# Altium project TD2_Project_TX.PrjPcb
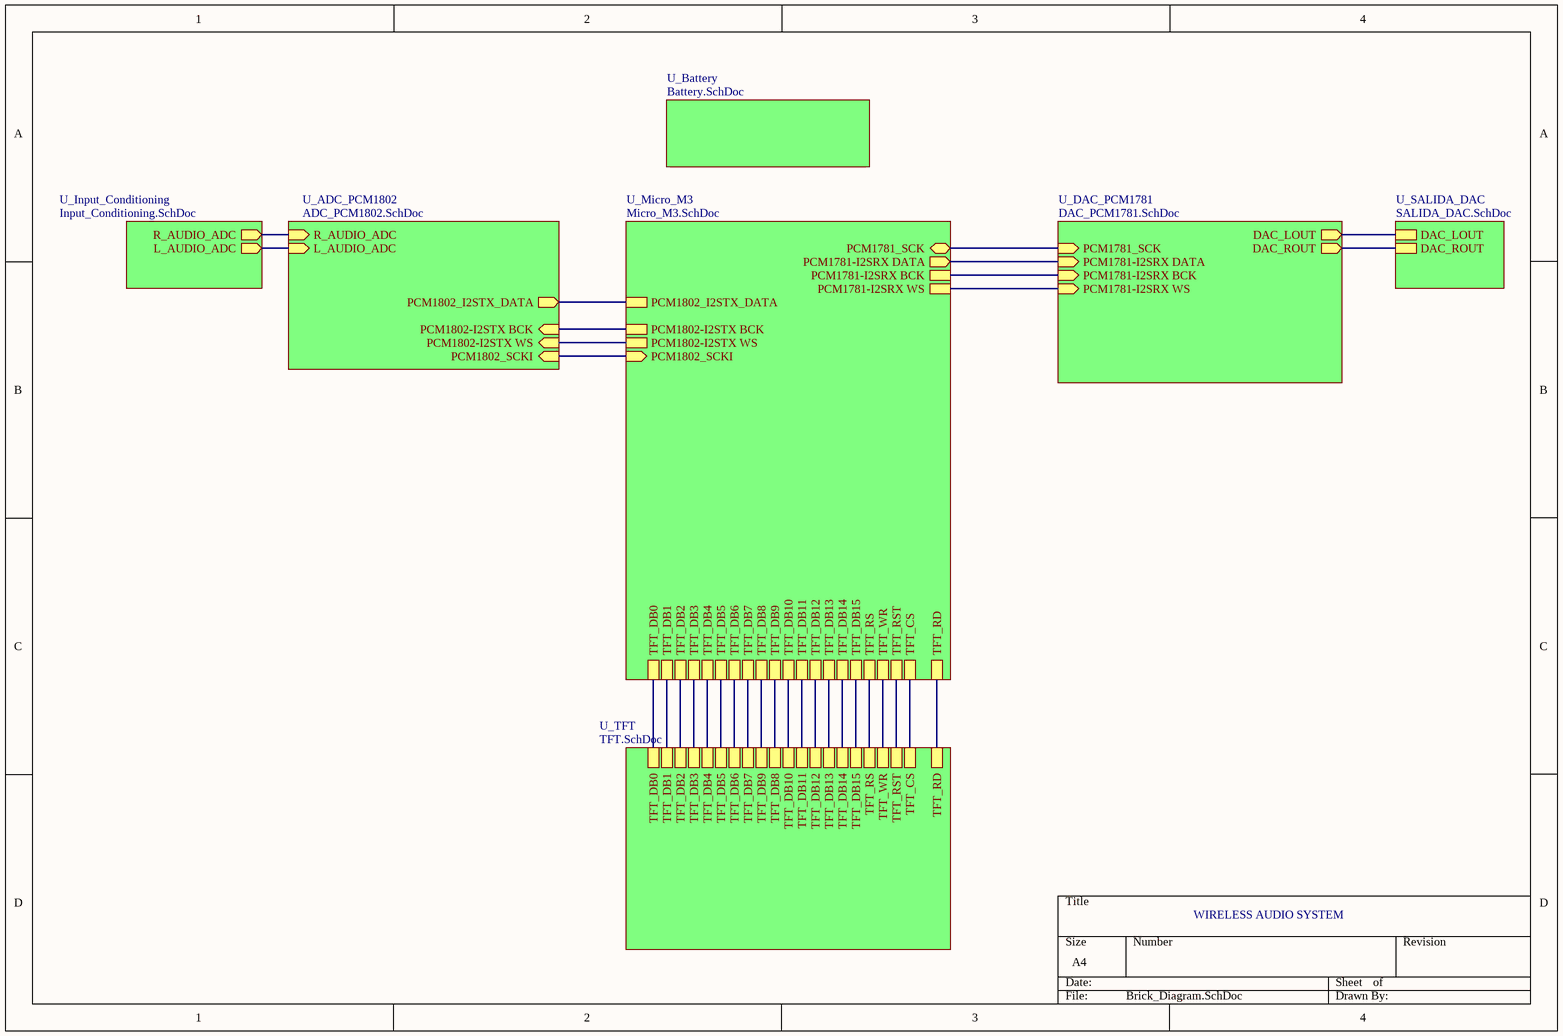
[diagram p0: Brick_Diagram.SchDoc]
8 sheets, 94 parts. Net scope: hierarchical (ports join the sheet entries above them; power ports are global).
Board file: TD2_Project_TX.PcbDoc
Sheets:
  Brick_Diagram.SchDoc
    U_Battery = Battery.SchDoc
    U_Input_Conditioning = Input_Conditioning.SchDoc
    U_DAC_PCM1781 = DAC_PCM1781.SchDoc
    U_Micro_M3 = Micro_M3.SchDoc
    U_ADC_PCM1802 = ADC_PCM1802.SchDoc
    U_SALIDA_DAC = SALIDA_DAC.SchDoc
    U_TFT = TFT.SchDoc

## Sheet Brick_Diagram.SchDoc
size A4

### Sub-sheets
U_ADC_PCM1802 = ADC_PCM1802.SchDoc: L_AUDIO_ADC (in), R_AUDIO_ADC (in), PCM1802-I2STX BCK (in), PCM1802_I2STX_DATA (out), PCM1802_SCKI (in), PCM1802-I2STX WS (in)
U_Battery = Battery.SchDoc: no entries
U_DAC_PCM1781 = DAC_PCM1781.SchDoc: PCM1781-I2SRX DATA (in), PCM1781-I2SRX BCK (in), PCM1781_SCK (in), PCM1781-I2SRX WS (in), DAC_LOUT (out), DAC_ROUT (out)
U_Input_Conditioning = Input_Conditioning.SchDoc: R_AUDIO_ADC (out), L_AUDIO_ADC (out)
U_Micro_M3 = Micro_M3.SchDoc: PCM1781_SCK (bidir), PCM1802-I2STX BCK, PCM1802-I2STX WS, PCM1802_I2STX_DATA, PCM1781-I2SRX BCK, PCM1781-I2SRX WS, PCM1781-I2SRX DATA (out), PCM1802_SCKI (in), TFT_DB0, TFT_DB1, TFT_DB2, TFT_DB4, TFT_DB5, TFT_DB3, TFT_DB6, TFT_DB8, TFT_DB9, TFT_DB7, TFT_DB10, TFT_DB11, TFT_DB12, TFT_DB13, TFT_DB14, TFT_DB15, TFT_RS, TFT_WR, TFT_RST, TFT_CS, TFT_RD
U_SALIDA_DAC = SALIDA_DAC.SchDoc: DAC_LOUT, DAC_ROUT
U_TFT = TFT.SchDoc: TFT_CS, TFT_WR, TFT_RST, TFT_DB0, TFT_DB1, TFT_DB2, TFT_DB3, TFT_DB4, TFT_DB5, TFT_DB6, TFT_DB7, TFT_DB9, TFT_DB8, TFT_DB10, TFT_DB11, TFT_DB12, TFT_DB13, TFT_DB14, TFT_DB15, TFT_RS, TFT_RD

### Nets
DAC_LOUT: sheet U_DAC_PCM1781/DAC_LOUT, sheet U_SALIDA_DAC/DAC_LOUT
DAC_ROUT: sheet U_DAC_PCM1781/DAC_ROUT, sheet U_SALIDA_DAC/DAC_ROUT
DB0: sheet U_Micro_M3/TFT_DB0, sheet U_TFT/TFT_DB0
DB1: sheet U_Micro_M3/TFT_DB1, sheet U_TFT/TFT_DB1
DB2: sheet U_Micro_M3/TFT_DB2, sheet U_TFT/TFT_DB2
DB3: sheet U_Micro_M3/TFT_DB3, sheet U_TFT/TFT_DB3
DB4: sheet U_Micro_M3/TFT_DB4, sheet U_TFT/TFT_DB4
DB5: sheet U_Micro_M3/TFT_DB5, sheet U_TFT/TFT_DB5
DB6: sheet U_Micro_M3/TFT_DB6, sheet U_TFT/TFT_DB6
DB7: sheet U_Micro_M3/TFT_DB7, sheet U_TFT/TFT_DB7
DB8: sheet U_Micro_M3/TFT_DB9, sheet U_TFT/TFT_DB8
DB9: sheet U_Micro_M3/TFT_DB8, sheet U_TFT/TFT_DB9
DB10: sheet U_Micro_M3/TFT_DB10, sheet U_TFT/TFT_DB10
DB11: sheet U_Micro_M3/TFT_DB11, sheet U_TFT/TFT_DB11
DB12: sheet U_Micro_M3/TFT_DB12, sheet U_TFT/TFT_DB12
DB13: sheet U_Micro_M3/TFT_DB13, sheet U_TFT/TFT_DB13
DB14: sheet U_Micro_M3/TFT_DB14, sheet U_TFT/TFT_DB14
DB15: sheet U_Micro_M3/TFT_DB15, sheet U_TFT/TFT_DB15
L_AUDIO_ADC: sheet U_Input_Conditioning/L_AUDIO_ADC, sheet U_ADC_PCM1802/L_AUDIO_ADC
PCM1781-BCK: sheet U_DAC_PCM1781/PCM1781-I2SRX BCK, sheet U_Micro_M3/PCM1781-I2SRX BCK
PCM1781-I2SRX DATA: sheet U_DAC_PCM1781/PCM1781-I2SRX DATA, sheet U_Micro_M3/PCM1781-I2SRX DATA
PCM1781-I2SRX WS: sheet U_DAC_PCM1781/PCM1781-I2SRX WS, sheet U_Micro_M3/PCM1781-I2SRX WS
PCM1781_SCK: sheet U_DAC_PCM1781/PCM1781_SCK, sheet U_Micro_M3/PCM1781_SCK
PCM1802_BCK: sheet U_Micro_M3/PCM1802-I2STX BCK, sheet U_ADC_PCM1802/PCM1802-I2STX BCK
PCM1802_DOUT: sheet U_Micro_M3/PCM1802_I2STX_DATA, sheet U_ADC_PCM1802/PCM1802_I2STX_DATA
PCM1802_LRCK: sheet U_Micro_M3/PCM1802-I2STX WS, sheet U_ADC_PCM1802/PCM1802-I2STX WS
PCM1802_SCKL: sheet U_Micro_M3/PCM1802_SCKI, sheet U_ADC_PCM1802/PCM1802_SCKI
R_AUDIO_ADC: sheet U_Input_Conditioning/R_AUDIO_ADC, sheet U_ADC_PCM1802/R_AUDIO_ADC
TFT_CS: sheet U_Micro_M3/TFT_CS, sheet U_TFT/TFT_CS
TFT_RD: sheet U_Micro_M3/TFT_RD, sheet U_TFT/TFT_RD
TFT_RS: sheet U_Micro_M3/TFT_RS, sheet U_TFT/TFT_RS
TFT_RST: sheet U_Micro_M3/TFT_RST, sheet U_TFT/TFT_RST
TFT_WR: sheet U_Micro_M3/TFT_WR, sheet U_TFT/TFT_WR

### Notes on the sheet
- WIRELESS AUDIO SYSTEM

## Sheet Battery.SchDoc
size A4
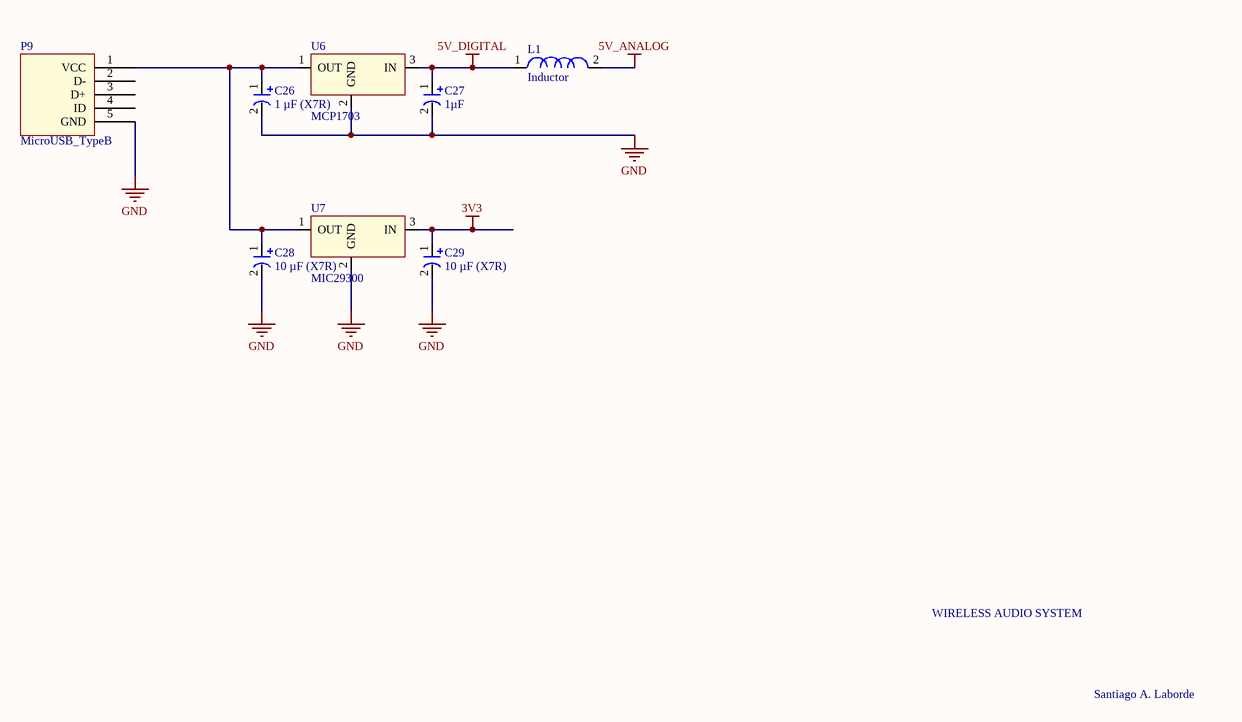
[diagram p1: Battery.SchDoc]

### Parts
C26  1 µF (X7R)  [RAD-0.1]
C27  1µF  [RAD-0.1]
C28  10 µF (X7R)  [RAD-0.1]
C29  10 µF (X7R)  [RAD-0.1]
L1  Inductor  [R_0805]
P9  MicroUSB_TypeB  [*TE_2013499-1]
U6  MCP1703  [SOT-223-3]
U7  MIC29300  [TO-263-3]

### Nets
3V3: C29.1 U7.3(IN)
5V_ANALOG: L1.2
5V_DIGITAL: C27.1 L1.1 U6.3(IN)
GND: C26.2 C27.2 C28.2 C29.2 P9.5(GND) U6.2(GND) U7.2(GND)  [project net DGND]
NetC26_1: C26.1 C28.1 P9.1(VCC) U6.1(OUT) U7.1(OUT)

Not connected (* = marked no-connect by the designer): P9 2(D-) 3(D+) 4(ID)

### Notes on the sheet
- WIRELESS AUDIO SYSTEM
- Santiago A. Laborde

### Library data of the parts
C26-C29 = Capacitor_Pol: Polarysed Capacitor
U6 = MCP1703: low dropout positive voltage regulators that / are capable of providing an output current that is in excess of 1.0 A / with a maximum dropout voltage of 1.2 V at 800 mA over / temperature. This series contains nine fixed output voltages of 1.5 V, / 1.8 V, 1.9 V, 2.0 V, 2.5 V, 2.85 V, 3.3 V, 5.0 V, and 12 V that have no / minimum load requirement to maintain regulation
U7 = MIC29300: low dropout positive voltage regulators that / are capable of providing an output current that is in excess of 1.0 A / with a maximum dropout voltage of 1.2 V at 800 mA over / temperature. This series contains nine fixed output voltages of 1.5 V, / 1.8 V, 1.9 V, 2.0 V, 2.5 V, 2.85 V, 3.3 V, 5.0 V, and 12 V that have no / minimum load requirement to maintain regulation

## Sheet Input_Conditioning.SchDoc
size A4
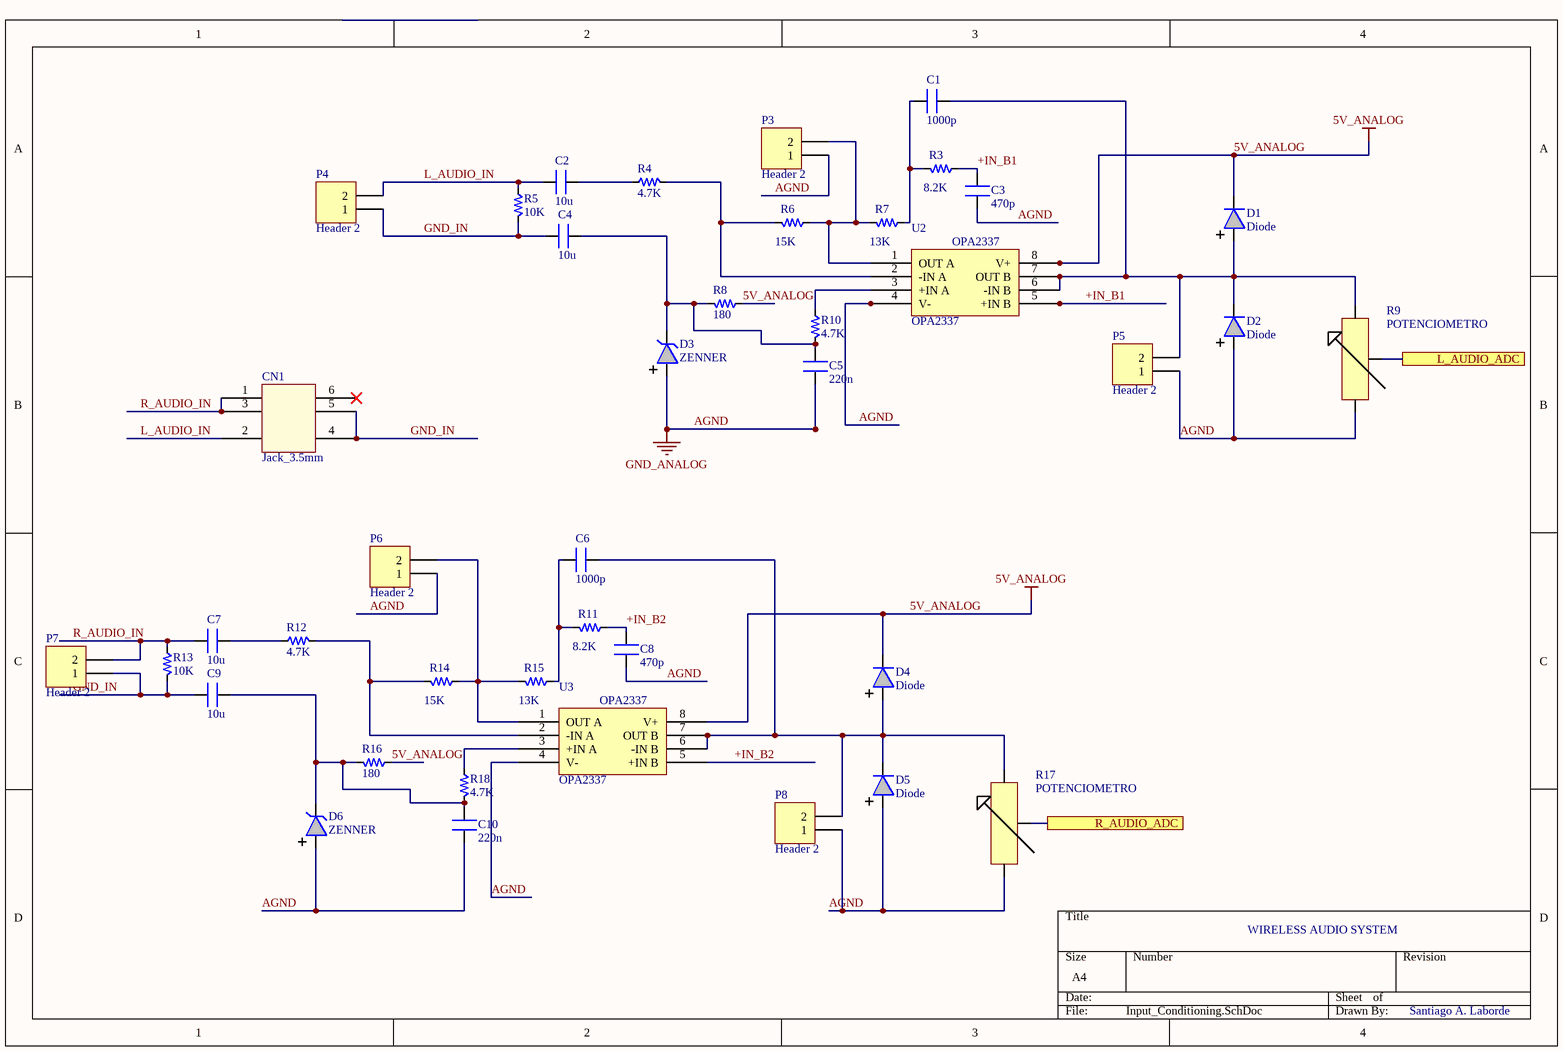
[diagram p2: Input_Conditioning.SchDoc]

### Parts
C1  1000p  [C_0805]
C2  10u  [RAD-0.1]
C3  470p  [C_0805]
C4  10u  [RAD-0.1]
C5  220n  [C_0805]
C6  1000p  [C_0805]
C7  10u  [RAD-0.1]
C8  470p  [C_0805]
C9  10u  [RAD-0.1]
C10  220n  [C_0805]
CN1  Jack_3.5mm  [JACK_3.5mm]
D1  Diode  [LED_0805]
D2  Diode  [LED_0805]
D3  ZENNER  [SOD123]
D4  Diode  [LED_0805]
D5  Diode  [LED_0805]
D6  ZENNER  [SOD123]
P3  Header 2  [Header1x2]
P4  Header 2  [Header1x2]
P5  Header 2  [Header1x2]
P6  Header 2  [Header1x2]
P7  Header 2  [Header1x2]
P8  Header 2  [Header1x2]
R3  8.2K  [R_0805]
R4  4.7K  [R_0805]
R5  10K  [R_0805]
R6  15K  [R_0805]
R7  13K  [R_0805]
R8  180  [R_0805]
R9  POTENCIOMETRO  [Potenciometro]
R10  4.7K  [R_0805]
R11  8.2K  [R_0805]
R12  4.7K  [R_0805]
R13  10K  [R_0805]
R14  15K  [R_0805]
R15  13K  [R_0805]
R16  180  [R_0805]
R17  POTENCIOMETRO  [Potenciometro]
R18  4.7K  [R_0805]
U2  OPA2337  [SOIC-8N]
U3  OPA2337  [SOIC-8N]

### Ports
L_AUDIO_ADC, R_AUDIO_ADC

### Nets
5V_ANALOG: D1.2 D4.2 R8.2 R16.2 U2.8(V+) U3.8(V+)
AGND: C3.2 C5.2 C8.2 C10.2 D2.1 D3.1 D5.1 D6.1 P3.1 P5.1 P6.1 P8.1 R9.2 R17.2 U2.4(V-) U3.4(V-)  [also labelled GND_ANALOG]
+IN_B1: C3.1 R3.2 U2.5(+IN_B)
+IN_B2: C8.1 R11.2 U3.5(+IN_B)
GND_IN: C4.1 C9.1 CN1.4 CN1.5 P4.1 P7.1 R5.1 R13.1
L_AUDIO_ADC: R9.3 ; port L_AUDIO_ADC
L_AUDIO_IN: C2.2 CN1.2 P4.2 R5.2
R_AUDIO_ADC: R17.3 ; port R_AUDIO_ADC
R_AUDIO_IN: C7.2 CN1.1 CN1.3 P7.2 R13.2
NetC1_1: C1.1 R3.1 R7.2
NetC1_2: C1.2 D1.1 D2.2 P5.2 R9.1 U2.6(-IN_B) U2.7(OUT_B)
NetC2_1: C2.1 R4.2
NetC4_2: C4.2 C5.1 D3.2 R8.1 R10.1
NetC6_1: C6.1 R11.1 R15.2
NetC6_2: C6.2 D4.1 D5.2 P8.2 R17.1 U3.6(-IN_B) U3.7(OUT_B)
NetC7_1: C7.1 R12.2
NetC9_2: C9.2 C10.1 D6.2 R16.1 R18.1
NetP3_2: P3.2 R6.2 R7.1 U2.1(OUT_A)
NetP6_2: P6.2 R14.2 R15.1 U3.1(OUT_A)
NetR4_1: R4.1 R6.1 U2.2(-IN_A)
NetR10_2: R10.2 U2.3(+IN_A)
NetR12_1: R12.1 R14.1 U3.2(-IN_A)
NetR18_2: R18.2 U3.3(+IN_A)

Not connected (* = marked no-connect by the designer): CN1 6*

### Notes on the sheet
- WIRELESS AUDIO SYSTEM
- Santiago A. Laborde

### Library data of the parts
C1-C10 = Capacitor_NP: Non Polarised Capacitor
P3-P8 = Header 2: Header, 2-Pin; LatestRevisionDate: 17-Jul-2002; LatestRevisionNote: Re-released for DXP Platform.; Publisher: Altium Limited
R3-R8 R10-R16 R18 = Resistor
R9 R17 = POTENCIOMETRO: pin to pad: 1>3 2>1 3>2

## Sheet DAC_PCM1781.SchDoc
size A4
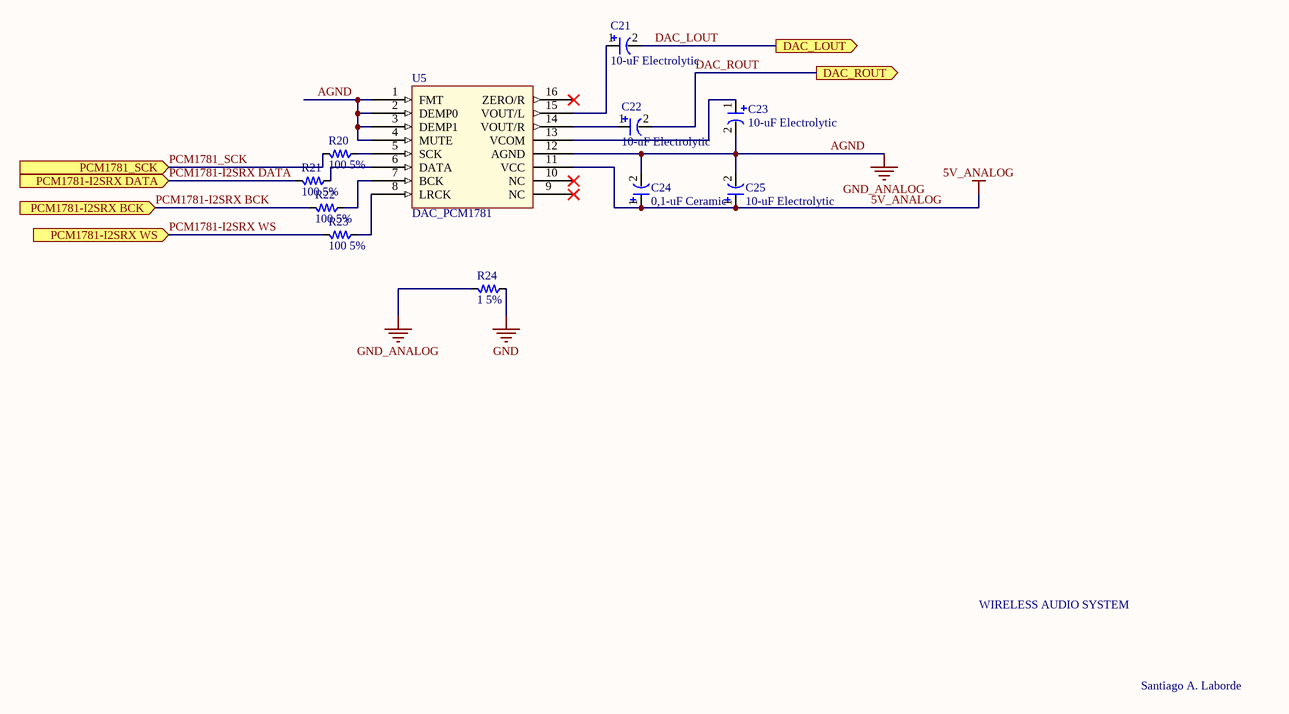
[diagram p3: DAC_PCM1781.SchDoc]

### Parts
C21  10-uF Electrolytic  [14-1210]
C22  10-uF Electrolytic  [14-1210]
C23  10-uF Electrolytic  [14-1210]
C24  0,1-uF Ceramic  [C_0805_Pol]
C25  10-uF Electrolytic  [14-1210]
R20  100 5%  [R_0805]
R21  100 5%  [R_0805]
R22  100 5%  [R_0805]
R23  100 5%  [R_0805]
R24  1 5%  [R_0805]
U5  DAC_PCM1781  [SSOP (16)]

### Ports
DAC_LOUT (out), DAC_ROUT (out), PCM1781-I2SRX BCK (in), PCM1781-I2SRX DATA (in), PCM1781-I2SRX WS (in), PCM1781_SCK (in)

### Nets
5V_ANALOG: C24.1 C25.1 U5.11(VCC)
AGND: C23.2 C24.2 C25.2 R24.1 U5.1(FMT) U5.2(DEMP0) U5.3(DEMP1) U5.4(MUTE) U5.12(AGND)  [also labelled GND_ANALOG]
GND: R24.2  [project net DGND]
DAC_LOUT: C21.2 ; port DAC_LOUT
DAC_ROUT: C22.2 ; port DAC_ROUT
PCM1781-I2SRX BCK: R22.1 ; port PCM1781-I2SRX BCK  [project net PCM1781-BCK]
PCM1781-I2SRX DATA: R21.1 ; port PCM1781-I2SRX DATA
PCM1781-I2SRX WS: R23.1 ; port PCM1781-I2SRX WS
PCM1781_SCK: R20.1 ; port PCM1781_SCK
NetC21_1: C21.1 U5.15(VOUT/L)
NetC22_1: C22.1 U5.14(VOUT/R)
NetC23_1: C23.1 U5.13(VCOM)
NetR20_2: R20.2 U5.5(SCK)
NetR21_2: R21.2 U5.6(DATA)
NetR22_2: R22.2 U5.7(BCK)
NetR23_2: R23.2 U5.8(LRCK)

Not connected (* = marked no-connect by the designer): U5 9(NC)* 10(NC)* 16(ZERO/R)*

### Notes on the sheet
- WIRELESS AUDIO SYSTEM
- Santiago A. Laborde

### Library data of the parts
C21-C25 = Capacitor_Pol: Polarysed Capacitor
R20-R24 = Resistor
U5 = DAC_PCM1781: The PCM1780/81/82 is a CMOS, monolithic, integrated circuit, which includes stereo digital-to-analog converters and support circuitry in a small 16-lead SSOP package. The data converters use TI’s enhanced multilevel delta-sigma architecture to achieve excellent dynamic performance an improved tolerance to clock jitter. Sampling rates up to 200 kHz are supported.

## Sheet Micro_M3.SchDoc
size B; Author: Santiago A. Laborde
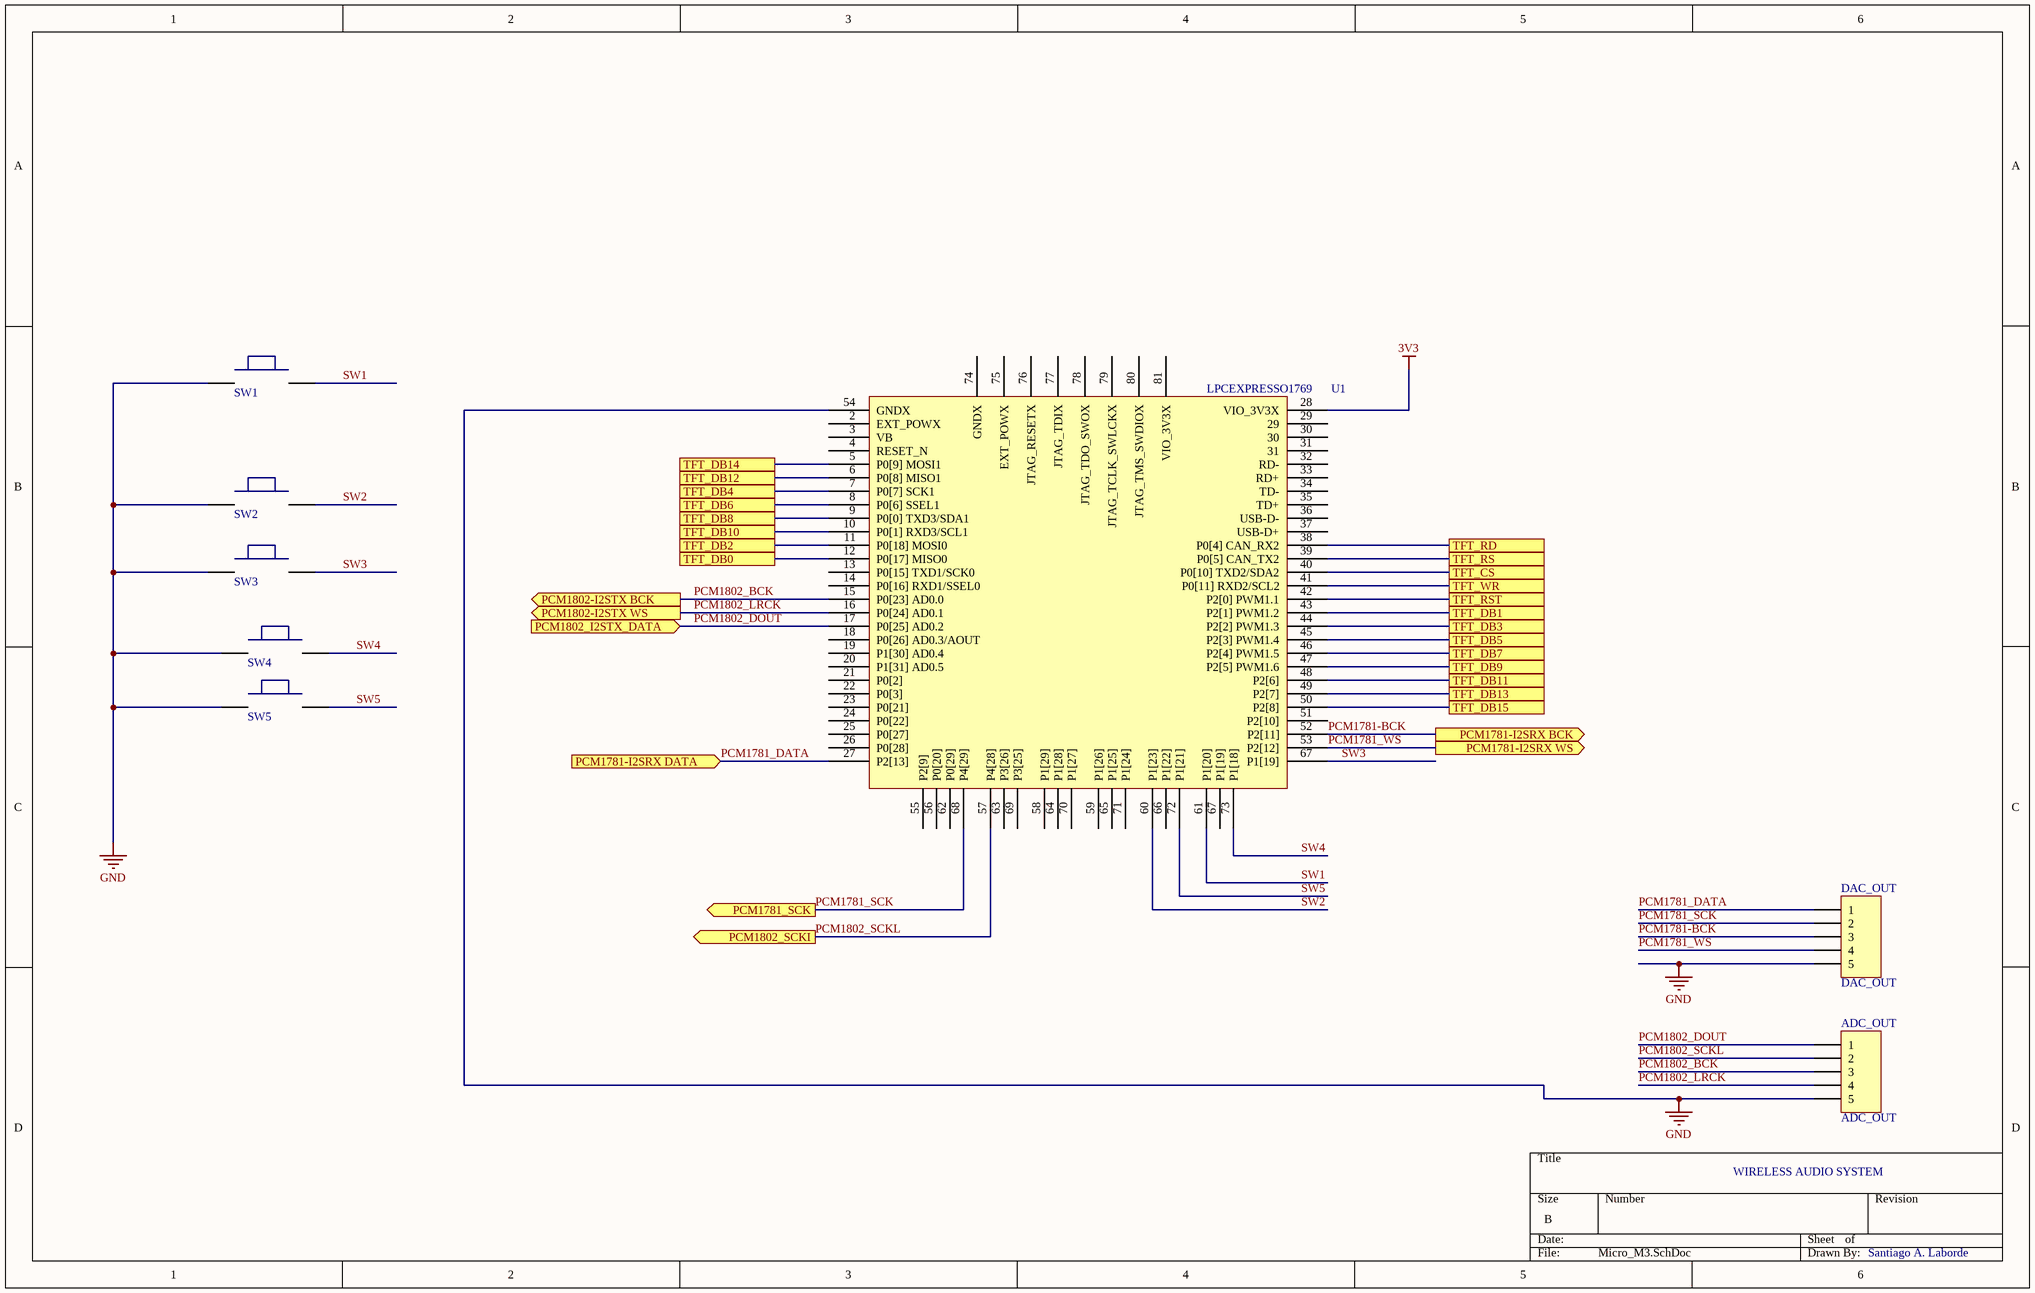
[diagram p4: Micro_M3.SchDoc]

### Parts
ADC_OUT  ADC_OUT  [HDR1X5]
DAC_OUT  DAC_OUT  [HDR1X5]
SW1  PULSADOR  [Pulsador]  (value not drawn)
SW2  PULSADOR  [Pulsador]  (value not drawn)
SW3  PULSADOR  [Pulsador]  (value not drawn)
SW4  PULSADOR  [Pulsador]  (value not drawn)
SW5  PULSADOR  [SW_SMD(2)]  (value not drawn)
U1  LPCEXPRESSO1769  [LPCEXPRESSO1769]

### Ports
PCM1781-I2SRX BCK (out), PCM1781-I2SRX DATA (in), PCM1781-I2SRX WS (out), PCM1781_SCK (out), PCM1802-I2STX BCK (out), PCM1802-I2STX WS (out), PCM1802_I2STX_DATA (in), PCM1802_SCKI (out), TFT_CS, TFT_DB0, TFT_DB1, TFT_DB2, TFT_DB3, TFT_DB4, TFT_DB5, TFT_DB6, TFT_DB7, TFT_DB8, TFT_DB9, TFT_DB10, TFT_DB11, TFT_DB12, TFT_DB13, TFT_DB14, TFT_DB15, TFT_RD, TFT_RS, TFT_RST, TFT_WR

### Nets
3V3: U1.28(VIO_3V3X)
GND: ADC_OUT.5 DAC_OUT.5 SW1.1 SW2.1 SW3.1 SW4.1 SW5.1 U1.54(GNDX)  [project net DGND]
DB0: U1.12(P0[17]_MISO0) ; port TFT_DB0
DB1: U1.43(P2[1]_PWM1.2) ; port TFT_DB1
DB2: U1.11(P0[18]_MOSI0) ; port TFT_DB2
DB3: U1.44(P2[2]_PWM1.3) ; port TFT_DB3
DB4: U1.7(P0[7]_SCK1) ; port TFT_DB4
DB5: U1.45(P2[3]_PWM1.4) ; port TFT_DB5
DB6: U1.8(P0[6]_SSEL1) ; port TFT_DB6
DB7: U1.46(P2[4]_PWM1.5) ; port TFT_DB7
DB8: U1.47(P2[5]_PWM1.6) ; port TFT_DB9
DB9: U1.9(P0[0]_TXD3/SDA1) ; port TFT_DB8
DB10: U1.10(P0[1]_RXD3/SCL1) ; port TFT_DB10
DB11: U1.48(P2[6]) ; port TFT_DB11
DB12: U1.6(P0[8]_MISO1) ; port TFT_DB12
DB13: U1.49(P2[7]) ; port TFT_DB13
DB14: U1.5(P0[9]_MOSI1) ; port TFT_DB14
DB15: U1.50(P2[8]) ; port TFT_DB15
PCM1781-BCK: DAC_OUT.3 U1.52(P2[11]) ; port PCM1781-I2SRX BCK
PCM1781_DATA: DAC_OUT.1 U1.27(P2[13]) ; port PCM1781-I2SRX DATA  [project net PCM1781-I2SRX DATA]
PCM1781_SCK: DAC_OUT.2 U1.68(P4[29]) ; port PCM1781_SCK
PCM1781_WS: DAC_OUT.4 U1.53(P2[12]) ; port PCM1781-I2SRX WS  [project net PCM1781-I2SRX WS]
PCM1802_BCK: ADC_OUT.3 U1.15(P0[23]_AD0.0) ; port PCM1802-I2STX BCK
PCM1802_DOUT: ADC_OUT.1 U1.17(P0[25]_AD0.2) ; port PCM1802_I2STX_DATA
PCM1802_LRCK: ADC_OUT.4 U1.16(P0[24]_AD0.1) ; port PCM1802-I2STX WS
PCM1802_SCKL: ADC_OUT.2 U1.57(P4[28]) ; port PCM1802_SCKI
SW1: SW1.2 U1.61(P1[20])
SW2: SW2.2 U1.60(P1[23])
SW3: SW3.2 U1.67(P1[19])
SW4: SW4.2 U1.73(P1[18])
SW5: SW5.2 U1.72(P1[21])
TFT_CS: U1.40(P0[10]_TXD2/SDA2) ; port TFT_CS
TFT_RD: U1.38(P0[4]_CAN_RX2) ; port TFT_RD
TFT_RS: U1.39(P0[5]_CAN_TX2) ; port TFT_RS
TFT_RST: U1.42(P2[0]_PWM1.1) ; port TFT_RST
TFT_WR: U1.41(P0[11]_RXD2/SCL2) ; port TFT_WR

Not connected (* = marked no-connect by the designer): U1 2(EXT_POWX) 3(VB) 4(RESET_N) 13(P0[15]_TXD1/SCK0) 14(P0[16]_RXD1/SSEL0) 18(P0[26]_AD0.3/AOUT) 19(P1[30]_AD0.4) 20(P1[31]_AD0.5) 21(P0[2]) 22(P0[3]) 23(P0[21]) 24(P0[22]) 25(P0[27]) 26(P0[28]) 29 30 31 32(RD-) 33(RD+) 34(TD-) 35(TD+) 36(USB-D-) 37(USB-D+) 51(P2[10]) 55(P2[9]) 56(P0[20]) 58(P1[29]) 59(P1[26]) 62(P0[29]) 63(P3[26]) 64(P1[28]) 65(P1[25]) 66(P1[22]) 69(P3[25]) 70(P1[27]) 71(P1[24]) 74(GNDX) 75(EXT_POWX) 76(JTAG_RESETX) 77(JTAG_TDIX) 78(JTAG_TDO_SWOX) 79(JTAG_TCLK_SWLCKX) 80(JTAG_TMS_SWDIOX) 81(VIO_3V3X)

### Notes on the sheet
- WIRELESS AUDIO SYSTEM

### Library data of the parts
ADC_OUT DAC_OUT = Header 5: Header, 5-Pin; LatestRevisionDate: 17-Jul-2002; LatestRevisionNote: Re-released for DXP Platform.; Publisher: Altium Limited

## Sheet ADC_PCM1802.SchDoc
size A4
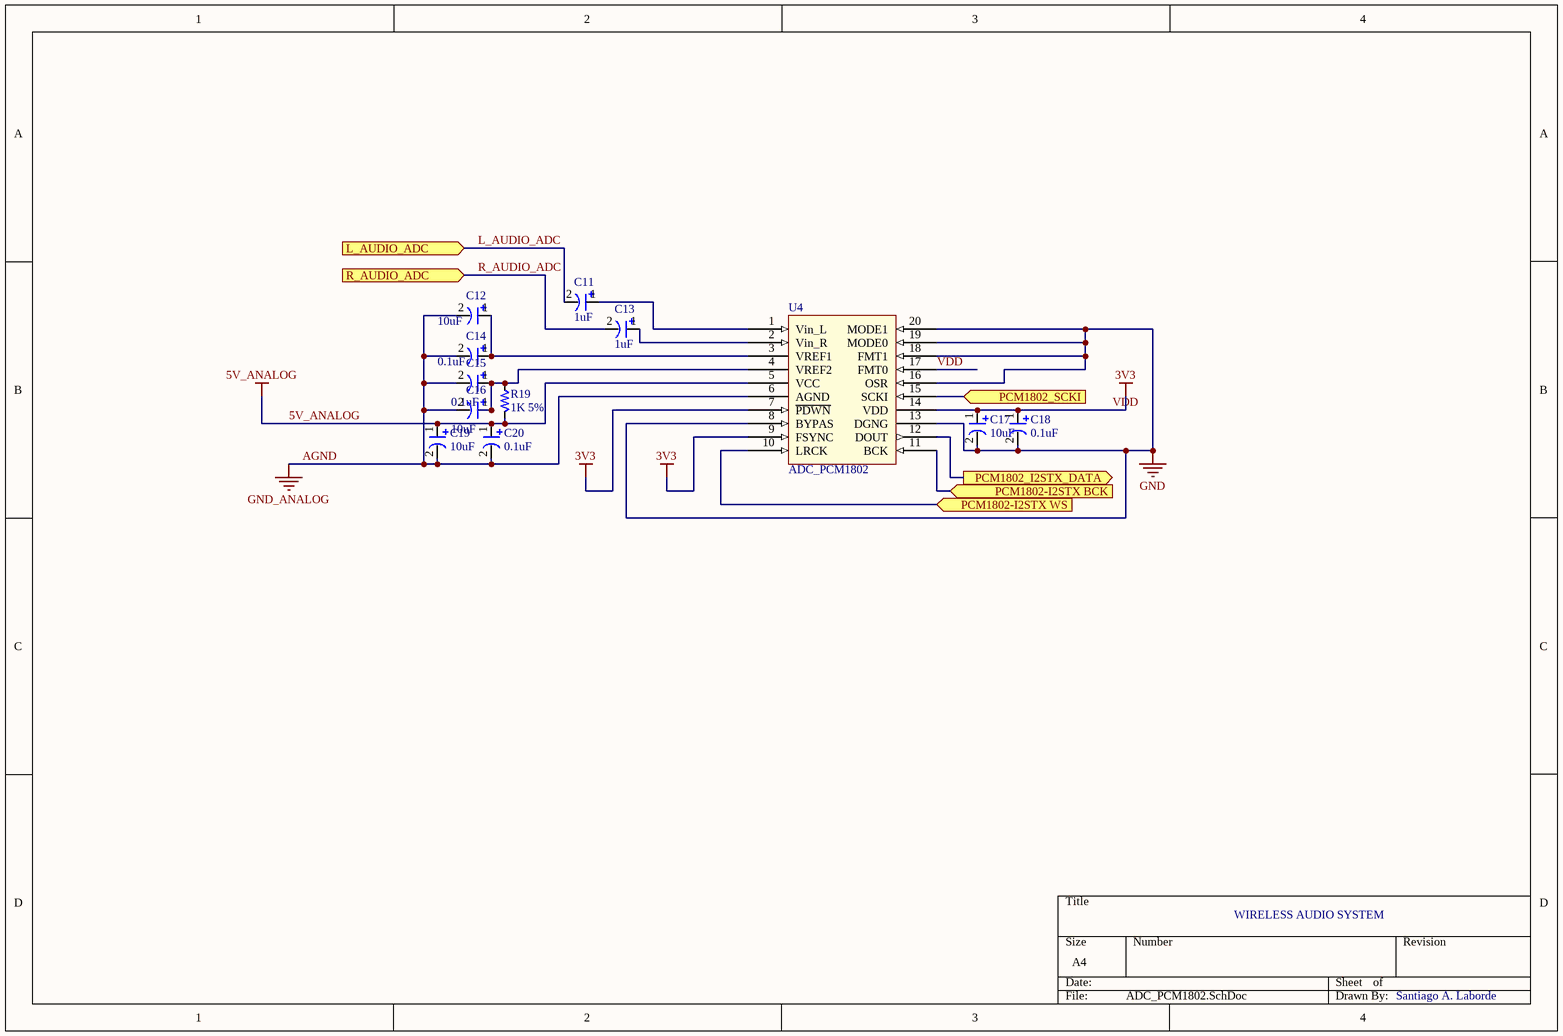
[diagram p5: ADC_PCM1802.SchDoc]

### Parts
C11  1uF  [RAD-0.1]
C12  10uF  [14-1210]
C13  1uF  [RAD-0.1]
C14  0.1uF  [C_0805_Pol]
C15  0.1uF  [C_0805_Pol]
C16  10uF  [14-1210]
C17  10uF  [14-1210]
C18  0.1uF  [C_0805_Pol]
C19  10uF  [14-1210]
C20  0.1uF  [C_0805_Pol]
R19  1K 5%  [R_0805]
U4  ADC_PCM1802  [SSOP (20)]

### Ports
L_AUDIO_ADC (in), PCM1802-I2STX BCK (in), PCM1802-I2STX WS (in), PCM1802_I2STX_DATA (out), PCM1802_SCKI (in), R_AUDIO_ADC (in)

### Nets
3V3: C17.1 C18.1 U4.7(~{PDWN}) U4.9(FSYNC) U4.14(VDD) U4.17(FMT0)  [also labelled VDD]
5V_ANALOG: C19.1 C20.1 R19.1 U4.5(VCC)
AGND: C12.2 C14.2 C15.2 C16.2 C19.2 C20.2 U4.6(AGND)  [also labelled GND_ANALOG]
GND: C17.2 C18.2 U4.8(BYPAS) U4.13(DGNG) U4.16(OSR) U4.18(FMT1) U4.19(MODE0) U4.20(MODE1)  [project net DGND]
L_AUDIO_ADC: C11.2 ; port L_AUDIO_ADC
PCM1802_BCK: U4.11(BCK) ; port PCM1802-I2STX BCK
PCM1802_DOUT: U4.12(DOUT) ; port PCM1802_I2STX_DATA
PCM1802_LRCK: U4.10(LRCK) ; port PCM1802-I2STX WS
PCM1802_SCKL: U4.15(SCKI) ; port PCM1802_SCKI
R_AUDIO_ADC: C13.2 ; port R_AUDIO_ADC
NetC11_1: C11.1 U4.1(Vin_L)
NetC12_1: C12.1 C14.1 U4.3(VREF1)
NetC13_1: C13.1 U4.2(Vin_R)
NetC15_1: C15.1 C16.1 R19.2 U4.4(VREF2)

### Notes on the sheet
- WIRELESS AUDIO SYSTEM
- Santiago A. Laborde

### Library data of the parts
C11-C20 = Capacitor_Pol: Polarysed Capacitor
R19 = Resistor
U4 = ADC_PCM1802: The PCM1802 is a high-performance, low-cost, / single-chip stereo analog-to-digital converter with / single-ended analog voltage input. The PCM1802 / uses a delta-sigma modulator with 64-times or / 128‑times oversampling, and includes a digital / decimation filter and high-pass filter (HPF), which / removes the DC component of the input signal. For / various applications, the PCM1802 supports master / and slave modes and four data formats in serial / interface. The PCM1802 is suitable for a wide variety / of cost-sensitive consumer applications where good / performance, 5-V analog supply, and 3.3-V digital / supply operation is required. The PCM1802 is / fabricated using a highly advanced CMOS process / and is available in the DB 20-pin SSOP package.

## Sheet SALIDA_DAC.SchDoc
size A4
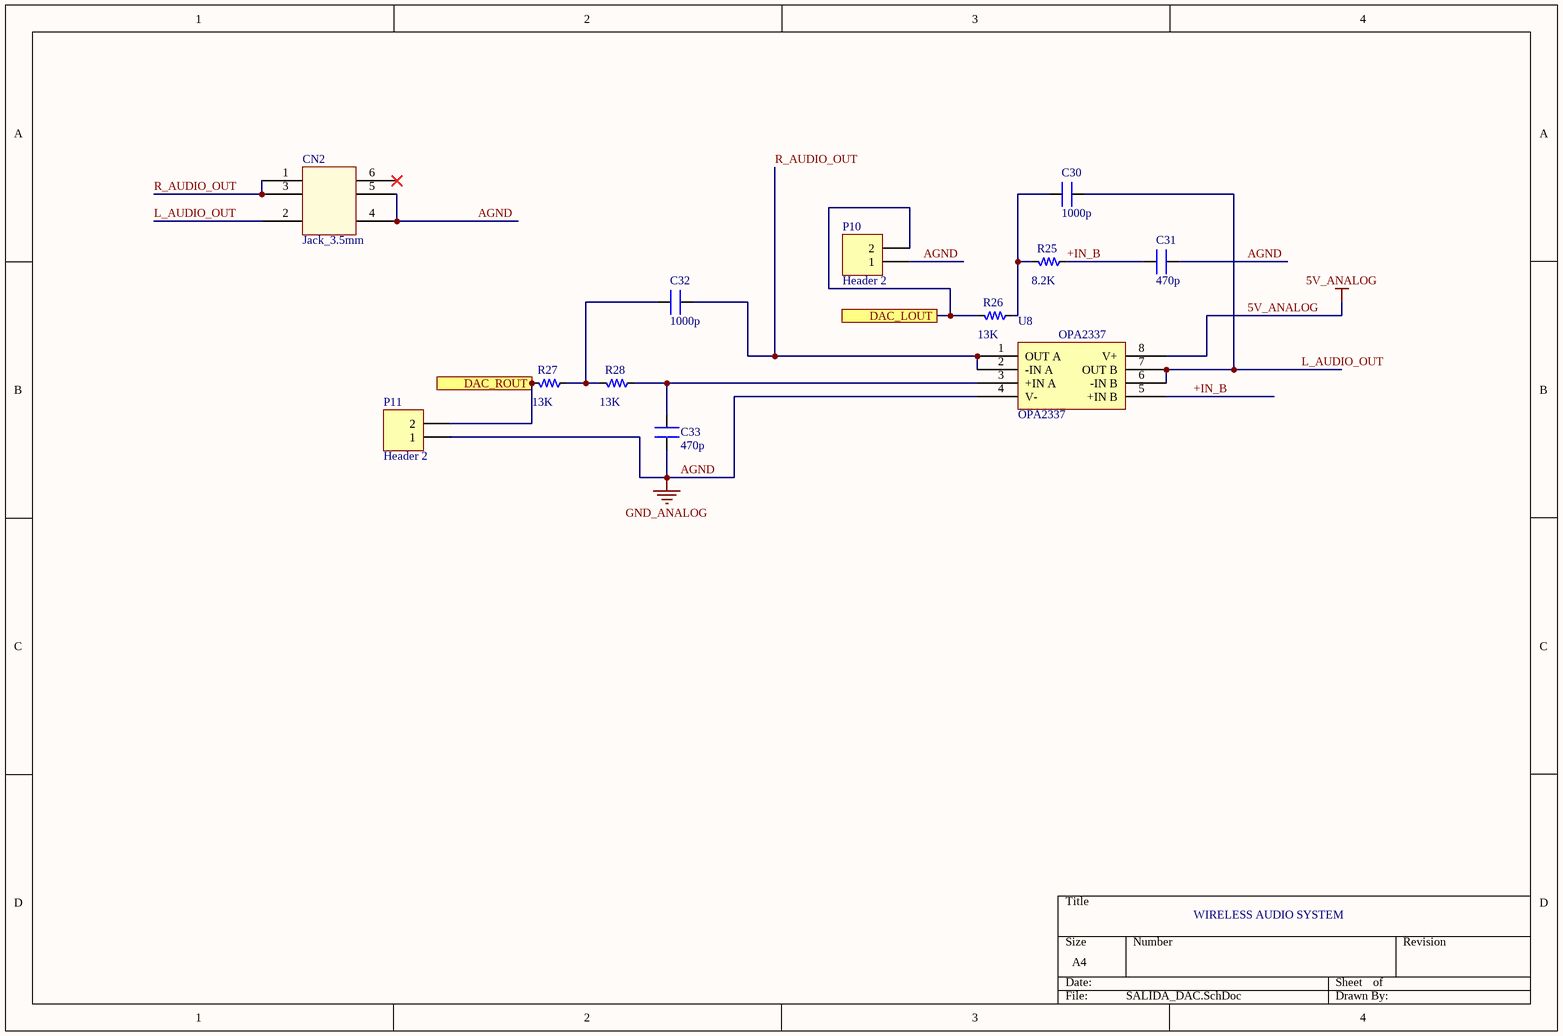
[diagram p6: SALIDA_DAC.SchDoc]

### Parts
C30  1000p  [C_0805]
C31  470p  [C_0805]
C32  1000p  [C_0805]
C33  470p  [C_0805]
CN2  Jack_3.5mm  [JACK_3.5mm]
P10  Header 2  [Header1x2]
P11  Header 2  [Header1x2]
R25  8.2K  [R_0805]
R26  13K  [R_0805]
R27  13K  [R_0805]
R28  13K  [R_0805]
U8  OPA2337  [SOIC-8N]

### Ports
DAC_LOUT, DAC_ROUT

### Nets
5V_ANALOG: U8.8(V+)
AGND: C31.2 C33.2 CN2.4 CN2.5 P10.1 P11.1 U8.4(V-)  [also labelled GND_ANALOG]
+IN_B: C31.1 R25.2 U8.5(+IN_B)
DAC_LOUT: P10.2 R26.1 ; port DAC_LOUT
DAC_ROUT: P11.2 R27.1 ; port DAC_ROUT
L_AUDIO_OUT: C30.2 CN2.2 U8.6(-IN_B) U8.7(OUT_B)
R_AUDIO_OUT: C32.2 CN2.1 CN2.3 U8.1(OUT_A) U8.2(-IN_A)
NetC30_1: C30.1 R25.1 R26.2
NetC32_1: C32.1 R27.2 R28.1
NetC33_1: C33.1 R28.2 U8.3(+IN_A)

Not connected (* = marked no-connect by the designer): CN2 6*

### Notes on the sheet
- WIRELESS AUDIO SYSTEM

### Library data of the parts
C30-C33 = Capacitor_NP: Non Polarised Capacitor
P10 P11 = Header 2: Header, 2-Pin; LatestRevisionDate: 17-Jul-2002; LatestRevisionNote: Re-released for DXP Platform.; Publisher: Altium Limited
R25-R28 = Resistor

## Sheet TFT.SchDoc
size A4
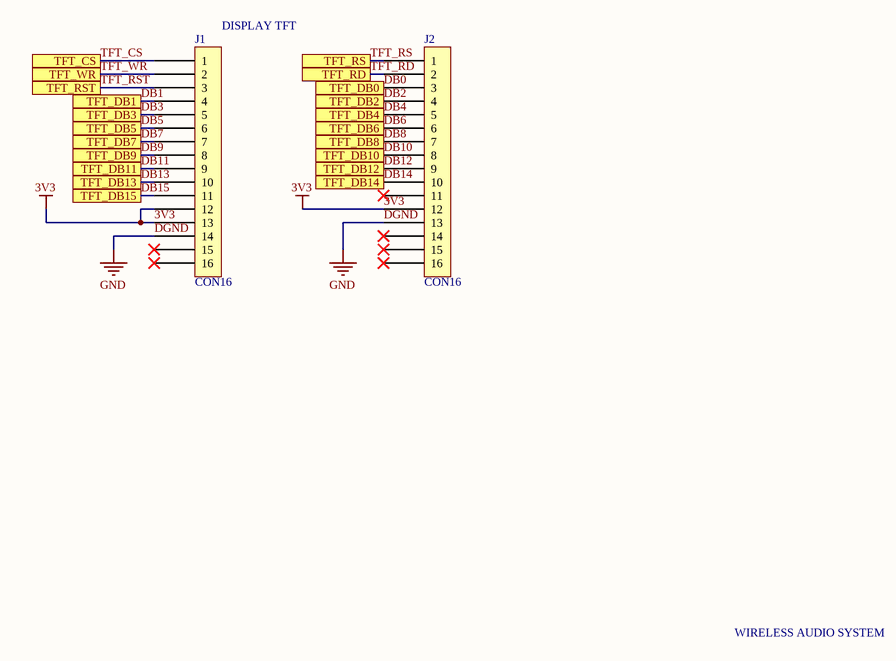
[diagram p7: TFT.SchDoc]

### Parts
J1  CON16  [HDR1X16]
J2  CON16  [HDR1X16]

### Ports
TFT_CS, TFT_DB0, TFT_DB1, TFT_DB2, TFT_DB3, TFT_DB4, TFT_DB5, TFT_DB6, TFT_DB7, TFT_DB8, TFT_DB9, TFT_DB10, TFT_DB11, TFT_DB12, TFT_DB13, TFT_DB14, TFT_DB15, TFT_RD, TFT_RS, TFT_RST, TFT_WR

### Nets
3V3: J1.12 J1.13 J2.12
DGND: J1.14 J2.13  [also labelled GND]
DB0: J2.3 ; port TFT_DB0
DB1: J1.4 ; port TFT_DB1
DB2: J2.4 ; port TFT_DB2
DB3: J1.5 ; port TFT_DB3
DB4: J2.5 ; port TFT_DB4
DB5: J1.6 ; port TFT_DB5
DB6: J2.6 ; port TFT_DB6
DB7: J1.7 ; port TFT_DB7
DB8: J2.7 ; port TFT_DB8
DB9: J1.8 ; port TFT_DB9
DB10: J2.8 ; port TFT_DB10
DB11: J1.9 ; port TFT_DB11
DB12: J2.9 ; port TFT_DB12
DB13: J1.10 ; port TFT_DB13
DB14: J2.10 ; port TFT_DB14
DB15: J1.11 ; port TFT_DB15
TFT_CS: J1.1 ; port TFT_CS
TFT_RD: J2.2 ; port TFT_RD
TFT_RS: J2.1 ; port TFT_RS
TFT_RST: J1.3 ; port TFT_RST
TFT_WR: J1.2 ; port TFT_WR

Not connected (* = marked no-connect by the designer): J1 15* 16*; J2 11* 14* 15* 16*

### Notes on the sheet
- (near J1) DISPLAY TFT
- WIRELESS AUDIO SYSTEM

## Nets that join several sheets
3V3: Battery (C29.1 U7.3), Micro_M3 (U1.28), ADC_PCM1802 (6 pins), TFT (J1.12 J1.13 J2.12)
5V_ANALOG: Battery (L1.2), Input_Conditioning (6 pins), DAC_PCM1781 (C24.1 C25.1 U5.11), ADC_PCM1802 (C19.1 C20.1 R19.1 U4.5), SALIDA_DAC (U8.8)
AGND: Input_Conditioning (16 pins), DAC_PCM1781 (9 pins), ADC_PCM1802 (7 pins), SALIDA_DAC (7 pins)
DGND: Battery (7 pins), DAC_PCM1781 (R24.2), Micro_M3 (8 pins), ADC_PCM1802 (8 pins), TFT (J1.14 J2.13)
DAC_LOUT: DAC_PCM1781 (C21.2), SALIDA_DAC (P10.2 R26.1)
DAC_ROUT: DAC_PCM1781 (C22.2), SALIDA_DAC (P11.2 R27.1)
DB0: Micro_M3 (U1.12), TFT (J2.3)
DB1: Micro_M3 (U1.43), TFT (J1.4)
DB2: Micro_M3 (U1.11), TFT (J2.4)
DB3: Micro_M3 (U1.44), TFT (J1.5)
DB4: Micro_M3 (U1.7), TFT (J2.5)
DB5: Micro_M3 (U1.45), TFT (J1.6)
DB6: Micro_M3 (U1.8), TFT (J2.6)
DB7: Micro_M3 (U1.46), TFT (J1.7)
DB8: Micro_M3 (U1.47), TFT (J2.7)
DB9: Micro_M3 (U1.9), TFT (J1.8)
DB10: Micro_M3 (U1.10), TFT (J2.8)
DB11: Micro_M3 (U1.48), TFT (J1.9)
DB12: Micro_M3 (U1.6), TFT (J2.9)
DB13: Micro_M3 (U1.49), TFT (J1.10)
DB14: Micro_M3 (U1.5), TFT (J2.10)
DB15: Micro_M3 (U1.50), TFT (J1.11)
L_AUDIO_ADC: Input_Conditioning (R9.3), ADC_PCM1802 (C11.2)
PCM1781-BCK: DAC_PCM1781 (R22.1), Micro_M3 (DAC_OUT.3 U1.52)
PCM1781-I2SRX DATA: DAC_PCM1781 (R21.1), Micro_M3 (DAC_OUT.1 U1.27)
PCM1781-I2SRX WS: DAC_PCM1781 (R23.1), Micro_M3 (DAC_OUT.4 U1.53)
PCM1781_SCK: DAC_PCM1781 (R20.1), Micro_M3 (DAC_OUT.2 U1.68)
PCM1802_BCK: Micro_M3 (ADC_OUT.3 U1.15), ADC_PCM1802 (U4.11)
PCM1802_DOUT: Micro_M3 (ADC_OUT.1 U1.17), ADC_PCM1802 (U4.12)
PCM1802_LRCK: Micro_M3 (ADC_OUT.4 U1.16), ADC_PCM1802 (U4.10)
PCM1802_SCKL: Micro_M3 (ADC_OUT.2 U1.57), ADC_PCM1802 (U4.15)
R_AUDIO_ADC: Input_Conditioning (R17.3), ADC_PCM1802 (C13.2)
TFT_CS: Micro_M3 (U1.40), TFT (J1.1)
TFT_RD: Micro_M3 (U1.38), TFT (J2.2)
TFT_RS: Micro_M3 (U1.39), TFT (J2.1)
TFT_RST: Micro_M3 (U1.42), TFT (J1.3)
TFT_WR: Micro_M3 (U1.41), TFT (J1.2)